# EAGLE design Main_PCB (EAGLE 9.5.1)

## Sheet 1 of 3
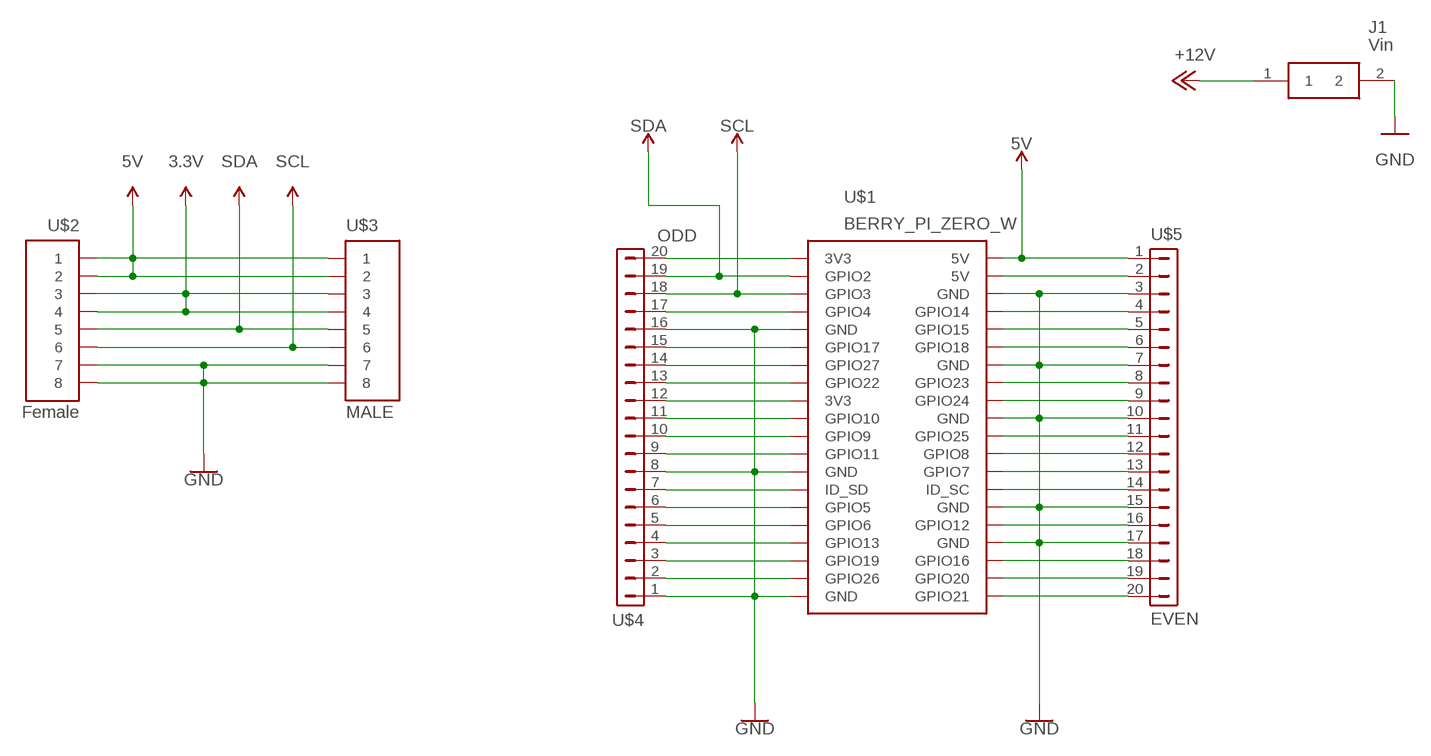
[diagram p0: schematic, sheet 1]

### Parts
J1  Vin  PUSH_TERMINAL_2WAYS  [1990009]
U$1  BERRY_PI_ZERO_W  [FE20-2]
U$2  Female  MODULARCONNECTOR  [MA04-2]
U$3  MALE  MODULARCONNECTOR  [MA04-2]
U$4  ODD  PARALLELHEADER  [FE20]
U$5  EVEN  PARALLELHEADER  [FE20]

### Nets
3.3V: U$2.3 U$2.4 U$3.3 U$3.4 ; also sheet 3
5V: U$1.2(5V) U$2.1 U$2.2 U$3.1 U$3.2 U$5.1 ; also sheet 2
5V@2: U$1.4(5V) U$5.2
+12V: J1.1 ; also sheet 2,3
GND: J1.2 U$1.6(GND) U$1.9(GND) U$1.14(GND) U$1.20(GND) U$1.25(GND) U$1.30(GND) U$1.34(GND) U$1.39(GND) U$2.7 U$2.8 U$3.7 U$3.8 U$4.1 U$4.8 U$4.16 U$5.3 U$5.7 U$5.10 U$5.15 U$5.17 ; also sheet 2,3
N$7: U$1.1(3V3) U$4.20
N$8: U$1.37(GPIO26) U$4.2
N$9: U$1.35(GPIO19) U$4.3
N$10: U$1.33(GPIO13) U$4.4
N$11: U$1.31(GPIO6) U$4.5
N$12: U$1.29(GPIO5) U$4.6
N$13: U$1.27(ID_SD) U$4.7
N$14: U$1.17(3V3) U$4.12
N$15: U$1.23(GPIO11) U$4.9
N$16: U$1.21(GPIO9) U$4.10
N$17: U$1.19(GPIO10) U$4.11
N$19: U$1.15(GPIO22) U$4.13
N$20: U$1.13(GPIO27) U$4.14
N$21: U$1.11(GPIO17) U$4.15
N$23: U$1.7(GPIO4) U$4.17
N$26: U$1.8(GPIO14) U$5.4
N$27: U$1.10(GPIO15) U$5.5
N$28: U$1.12(GPIO18) U$5.6
N$30: U$1.16(GPIO23) U$5.8
N$31: U$1.18(GPIO24) U$5.9
N$33: U$1.22(GPIO25) U$5.11
N$34: U$1.24(GPIO8) U$5.12
N$35: U$1.26(GPIO7) U$5.13
N$36: U$1.28(ID_SC) U$5.14
N$38: U$1.32(GPIO12) U$5.16
N$40: U$1.36(GPIO16) U$5.18
N$41: U$1.38(GPIO20) U$5.19
N$42: U$1.40(GPIO21) U$5.20
SCL: U$1.5(GPIO3) U$2.6 U$3.6 U$4.18
SDA: U$1.3(GPIO2) U$2.5 U$3.5 U$4.19

## Sheet 2 of 3: Buck 5Vout
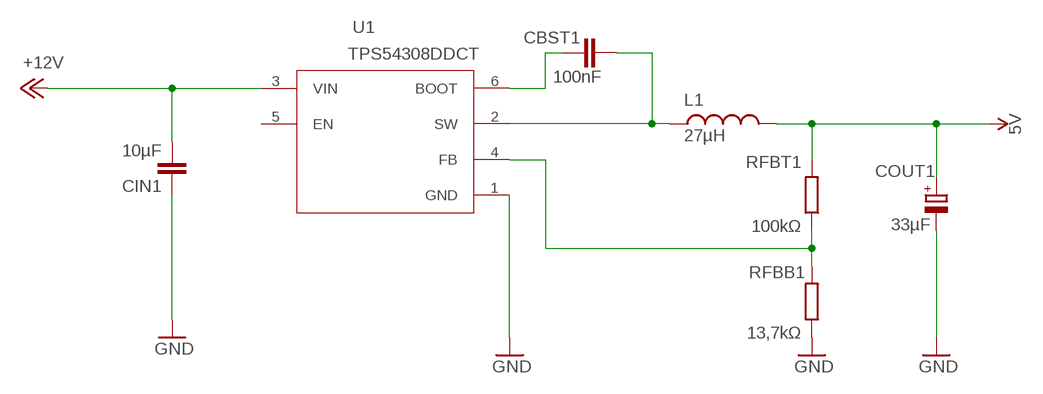
[diagram p1: schematic, sheet 2]

### Parts
CBST1  100nF  C-0603  [C0603]
CIN1  10µF  C-1210  [C1210]
COUT1  33µF  ELCO_TYPE_C  [PANASONIC_C]
L1  27µH  WE-PDF_1064_7447798910  [WE-PDF]
RFBB1  13,7kΩ  R-0603  [R0603]
RFBT1  100kΩ  R-0805  [R0805]
U1  TPS54308DDCT  [DDC6]

### Nets
5V: COUT1.+ L1.2 RFBT1.2 ; also sheet 1
+12V: CIN1.2 U1.3(VIN) ; also sheet 1,3
GND: CIN1.1 COUT1.- RFBB1.1 U1.1(GND) ; also sheet 1,3
N$3: CBST1.2 L1.1 U1.2(SW)
N$5: CBST1.1 U1.6(BOOT)
N$6: RFBB1.2 RFBT1.1 U1.4(FB)
Unconnected: U1.5(EN)

## Sheet 3 of 3: Buck 3.3Vout
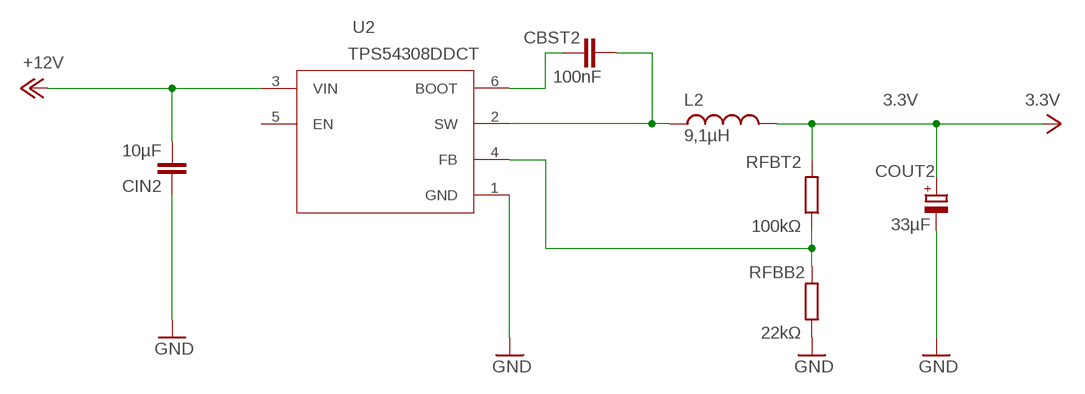
[diagram p2: schematic, sheet 3]

### Parts
CBST2  100nF  C-0603  [C0603]
CIN2  10µF  C-1210  [C1210]
COUT2  33µF  ELCO_TYPE_C  [PANASONIC_C]
L2  9,1µH  WE-PDF_1064_7447798910  [WE-PDF]
RFBB2  22kΩ  R-0603  [R0603]
RFBT2  100kΩ  R-0805  [R0805]
U2  TPS54308DDCT  [DDC6]

### Nets
3.3V: COUT2.+ L2.2 RFBT2.2 ; also sheet 1
+12V: CIN2.2 U2.3(VIN) ; also sheet 1,2
GND: CIN2.1 COUT2.- RFBB2.1 U2.1(GND) ; also sheet 1,2
N$1: CBST2.2 L2.1 U2.2(SW)
N$2: CBST2.1 U2.6(BOOT)
N$4: RFBB2.2 RFBT2.1 U2.4(FB)
Unconnected: U2.5(EN)

## Library data of the parts
CBST1 CBST2 = Main_lib:C-0603
CIN1 CIN2 = Main_lib:C-1210
COUT1 COUT2 = Main_lib:ELCO_TYPE_C
J1 = Main_lib:PUSH_TERMINAL_2WAYS: Phoenix Contact Non-Fused Terminal Block, 2 Way/Pole, Solder Terminals, 24 20 AWG Through Hole, Nylon, 160 V Source: Datasheet <https://componentsearchengine.com/Datasheets/1/1990009.pdf>; DESCRIPTION: Phoenix Contact Non-Fused Terminal Block, 2 Way/Pole, Solder Terminals, 24 20 AWG Through Hole, Nylon, 160 V; HEIGHT: 13mm; MANUFACTURER_NAME: Phoenix Contact; MANUFACTURER_PART_NUMBER: 1990009; MOUSER_PART_NUMBER: 651-1990009; MOUSER_PRICE-STOCK: https://www.mouser.com/Search/Refine.aspx?Keyword=651-1990009
L1 L2 = Main_lib:WE-PDF_1064: SMD Shielded Flatwire Power Inductor Characteristics Core material: NiZn Flat wire power inductor Advanced operating temperature: –40 °C up to +150 °C Magnetically shielded which results in a low leakage field Low self-losses High saturation current Flat wire coil for lower losses at high frequency ranges High Self Resonance Frequency Applications Suitable for high frequency switching regulators <http://katalog.we-online.de/media/images/v2/Family_WE-PDF%20Gruppe.jpg> Details see: http://katalog.we-online.de/en/pbs/WE-PDF? Updated by Dan Xu 2014-07-08 2014 (C) Wurth Elektronik; WE-NUMBER: 7447798910/9,1uH
RFBB1 RFBB2 = Main_lib:R-0603
RFBT1 RFBT2 = Main_lib:R-0805
U1 U2 = Main_lib:TPS54308DDCT; MANUFACTURER_PART_NUMBER: TPS54308DDCT; VENDOR: Texas Instruments
U$1 = Main_lib:BERRY_PI_ZERO_W
U$2 U$3 = Main_lib:MODULARCONNECTOR
U$4 U$5 = Main_lib:PARALLELHEADER

## Board
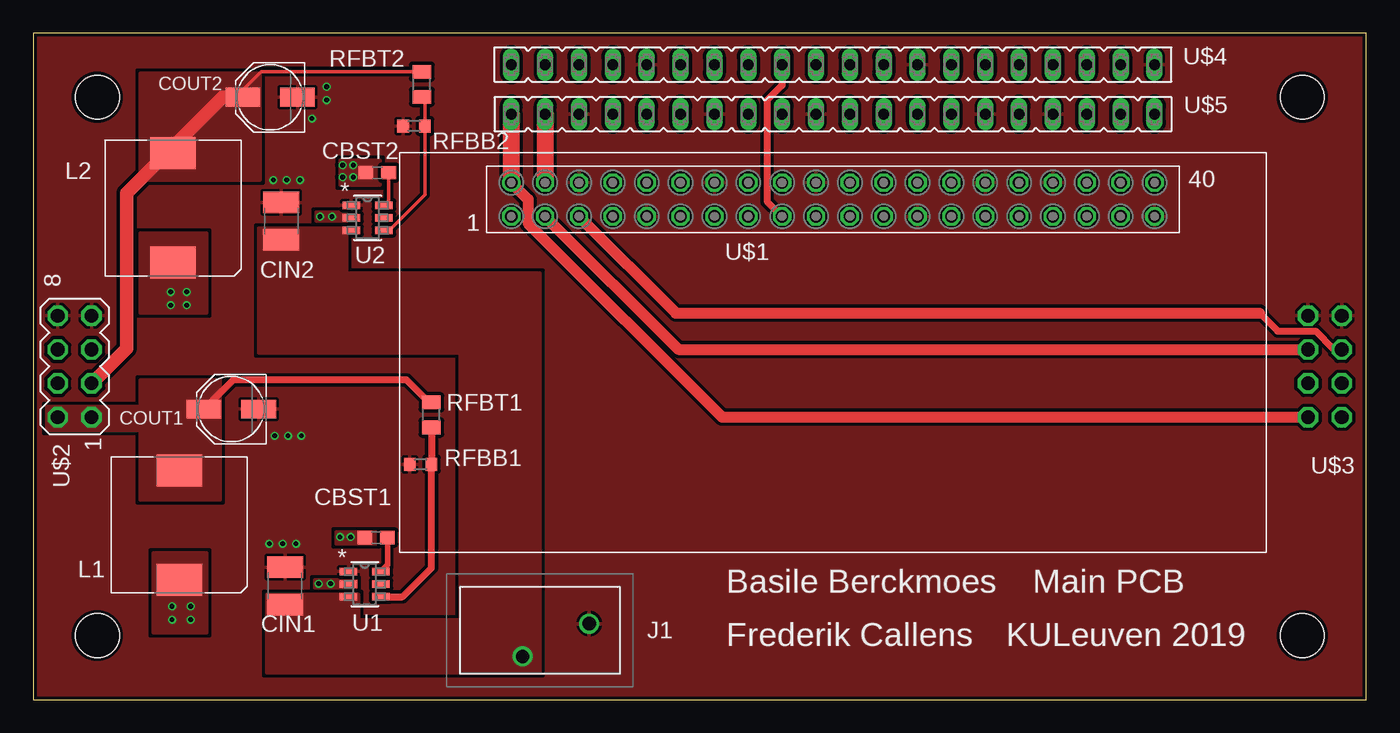
[diagram p3: board, top side]
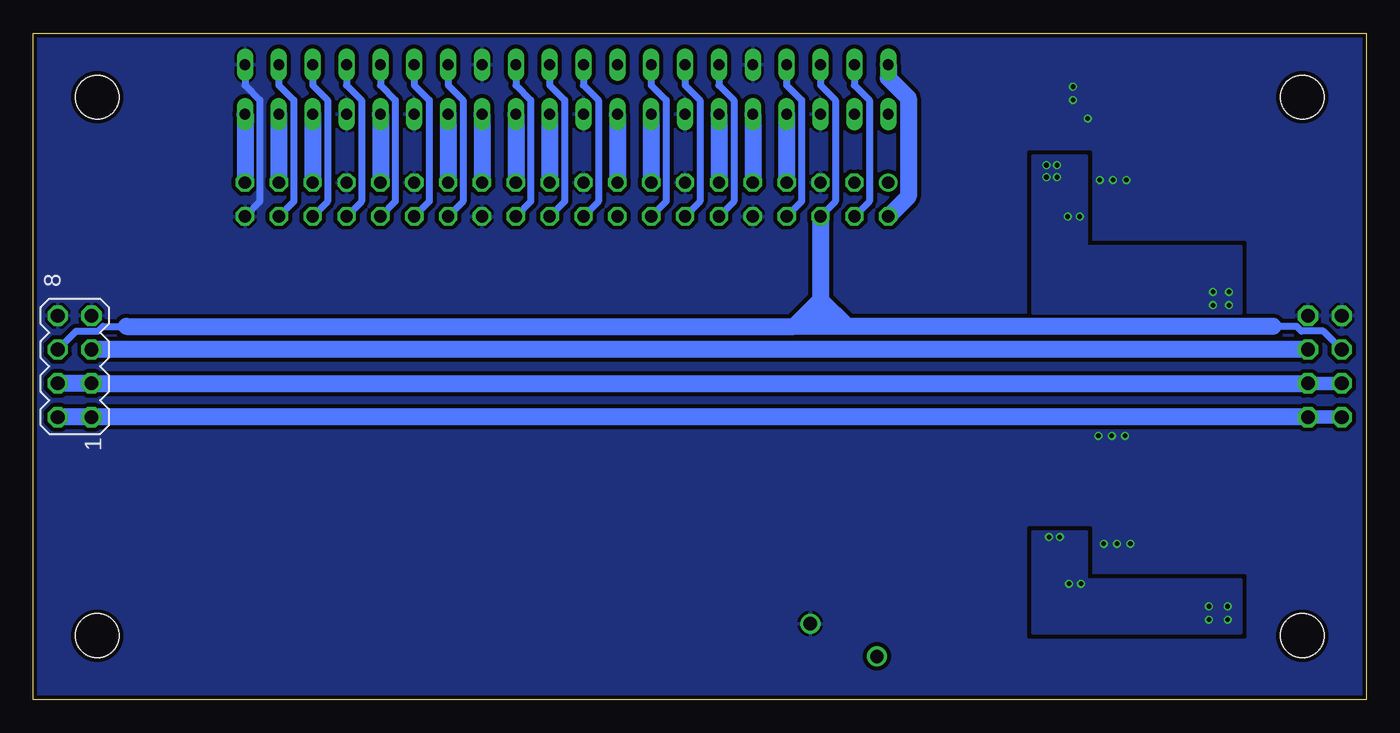
[diagram p4: board, bottom side, seen from below]

Size 100 x 50 mm. Coordinates in mm from the lower left corner, seen from the top.
Outline: 0,0 100,0 100,50 0,50 0,0
Copper layers (1*16): Top 0.018mm / dielectric 1.55mm / Bottom 0.018mm
Design rules "eC_2Layer_PClass6_BaseCopperO18_eCDefault": minimum track width 0.15mm, minimum drill 0.35mm, track to track 0.15mm, track to pad 0.15mm, pad to pad 0.15mm, via to via 0.15mm, smd to smd 0mil, copper to edge 0.25mm, drill to drill 0.35mm, minimum pad ring 0.175mm, minimum via ring 0.125mm, stop-mask expansion 0mil, vias tented up to drill 0.45mm, thermal gap 0.2mm
Holes 3.3 mm at 4.8,4.8 4.8,45.2 95.2,4.8 95.2,45.2

### Footprints (pad centres in the part's own frame; a part is rotated, then mirrored left to right if it is on the bottom)
C0603 = smd 1.1 x 1: 1 -0.85,0; 2 0.85,0
C1210 = smd 1.6 x 2.7: 1 -1.4,0; 2 1.4,0
PANASONIC_C = smd 2.6 x 1.4: + 2.05,0; - -2.05,0
1990009 = drill 1 pad 1.5: 1 1.22,-7.3; 2 -1.25,-2.3
WE-PDF = smd 2.4 x 3.4: 1 4.1,0; 2 -4.1,0
R0603 = smd 0.87 x 0.98: 1 -0.815,0; 2 0.815,0
R0805 = smd 1.02 x 1.4: 1 -0.94,0; 2 0.94,0
DDC6 = smd 1.321 x 0.559: 1 -1.219,0.95; 2 -1.219,0; 3 -1.219,-0.95; 4 1.219,-0.95; 5 1.219,0; 6 1.219,0.95
FE20-2 = drill 0.914 octagon: 1 -24.13,-1.27; 3 -21.59,-1.27; 4 -21.59,1.27; 5 -19.05,-1.27; 6 -19.05,1.27; 7 -16.51,-1.27; 8 -16.51,1.27; 9 -13.97,-1.27; 10 -13.97,1.27; 11 -11.43,-1.27; 12 -11.43,1.27; 13 -8.89,-1.27; 14 -8.89,1.27; 15 -6.35,-1.27; 16 -6.35,1.27; 17 -3.81,-1.27; 18 -3.81,1.27; 19 -1.27,-1.27; 20 -1.27,1.27; 21 1.27,-1.27; 22 1.27,1.27; 23 3.81,-1.27; 24 3.81,1.27; 25 6.35,-1.27; 26 6.35,1.27; 27 8.89,-1.27; 28 8.89,1.27; 29 11.43,-1.27; 30 11.43,1.27; 31 13.97,-1.27; 32 13.97,1.27; 33 16.51,-1.27; 34 16.51,1.27; 35 19.05,-1.27; 36 19.05,1.27; 37 21.59,-1.27; 38 21.59,1.27; 39 24.13,-1.27; 40 24.13,1.27 | drill 0.914: 2 -24.13,1.27
MA04-2 = drill 1.016 octagon: 1 -3.81,-1.27; 2 -3.81,1.27; 3 -1.27,-1.27; 4 -1.27,1.27; 5 1.27,-1.27; 6 1.27,1.27; 7 3.81,-1.27; 8 3.81,1.27
FE20 = drill 0.813 long: 1 -24.13,0; 2 -21.59,0; 3 -19.05,0; 4 -16.51,0; 5 -13.97,0; 6 -11.43,0; 7 -8.89,0; 8 -6.35,0; 9 -3.81,0; 10 -1.27,0; 11 1.27,0; 12 3.81,0; 13 6.35,0; 14 8.89,0; 15 11.43,0; 16 13.97,0; 17 16.51,0; 18 19.05,0; 19 21.59,0; 20 24.13,0

### Placement (x,y rotation side)
CBST1  25.72,12.16 180 top
CBST2  25.8,39.54 180 top
CIN1  18.88,8.53 270 top
CIN2  18.61,35.91 270 top
COUT1  14.85,21.8 180 top
COUT2  17.77,45.2 180 top
J1  44.01,4.45 270 top
L1  10.95,13.1 270 top
L2  10.48,36.9 270 top
RFBB1  29.06,17.66 0 top
RFBB2  28.56,43.04 0 top
RFBT1  29.86,21.36 90 top
RFBT2  29.15,46.17 90 top
U1  24.87,8.66 0 top
U2  25.08,36.15 0 top
U$1  59.99,37.53 0 top
U$2  3.1,25 90 top
U$3  96.9,25 90 bottom
U$4  59.99,47.65 180 top
U$5  59.99,43.93 0 top

### Tracks (layer width: path | path; a pad name or v marks a point on that pad's centre or on a via)
3.3V
  Top 0.254: RFBT2.2 17.11,47.11 15.72,45.72 COUT2.+
  Top 1.016: U$2.3 7,26.36 7,38 14.2,45.2 COUT2.+
  Bottom 1.016: U$2.3 U$2.4
  Bottom 1.27: U$2.3 U$3.3 U$3.4
  pour Top (isolate 0.254, no thermals): 8,47 8,39 17,39 17,47
5V
  Top 0.508: RFBT1.2 29.7,22.3 28,24 15,24 COUT1.+
  Top 0.813: U$1.2 37.13,37.53 37.13,35.73 51.67,21.19 U$3.1
  Top 1.27: U$5.1 U$1.2
  Bottom 1.016: U$2.1 U$2.2
  Bottom 1.27: U$2.1 U$3.1 U$3.2
  pour Top (isolate 0.254, no thermals): 8,24 8,15 14,15 14,24
  pour Top (isolate 0.254, no thermals): 1,22 9,22 9,20.2 1,20.2
5V@2
  Top 1.27: U$5.2 U$1.4
+12V
  pour Top (isolate 0.254, no thermals): 16.9,35.4 23.5,35.4 23.5,26 16.9,26
  pour Top (isolate 0.254, no thermals): 17.5,2 17.5,7.9 24.4,7.9 24.4,2
  pour Top (isolate 0.254, no thermals): 24.1,6 38,6 38,2 24.1,2
  pour Top (isolate 0.254, no thermals): 23,32 38,32 38,5 32,5 32,26 23,26
GND  (via drill 0.35)
  Bottom 0.508: U$4.1 84.12,46.1 83,44.98 83,37.38 U$1.39
  other vias: 22,46 22,45 18,39 19,39 20.9,43.6 20,39 20.1,19.8 19.1,19.8 18.1,19.8 17.7,11.7 18.7,11.7 19.7,11.7
  pour Top (isolate 0.254, rank 3): 0,50 0,0 100,0 100,50
  pour Bottom (isolate 0.3, rank 3): 0,50 100,50 100,0 0,0
N$1  (via drill 0.35)
  other vias: 10.3,30.6 11.5,30.6 11.5,29.6 10.3,29.6 24,39.2 24,40.1 22.4,36.25 21.5,36.25 23.2,40.1 23.2,39.2
  pour Top (isolate 0.254, no thermals): 23,40.5 23,38.6 26,38.6 26,40.5
  pour Top (isolate 0.254, no thermals): 23.5,35.9 23.5,36.6 21.2,36.6 21.2,35.9
  pour Top (isolate 0.254, no thermals): 8,34 8,29 13,29 13,35 8,35
  pour Bottom (isolate 0.254, no thermals): 21,40.8 21,29 25,29 25,40.8
  pour Bottom (isolate 0.254, no thermals): 21,29 9.4,29 9.4,34 21,34
N$2
  Top 0.254: U2.6 26.65,37.45 CBST2.1
N$3  (via drill 0.35)
  other vias: 10.4,7 11.8,7 11.8,6 10.4,6 22.3,8.7 21.4,8.7 23,12.2 23.8,12.2
  pour Top (isolate 0.254, no thermals): 26.4,11.7 26.4,12.6 22.7,12.6 22.7,11.7
  pour Top (isolate 0.254, no thermals): 21.1,9 21.1,8.4 24.2,8.4 24.2,9
  pour Top (isolate 0.254, no thermals): 9,11 9,5 13,5 13,11
  pour Bottom (isolate 0.254, no thermals): 9.4,9 9.4,5 25,5 25,12.6 21,12.6 21,9
N$4
  Top 0.254: U2.4 26.68,35.2 29.38,37.89 RFBB2.2 29.38,45.01 RFBT2.1
N$5
  Top 0.406: U1.6 26.57,10.09 CBST1.1
N$6
  Top 0.508: RFBT1.1 29.88,20.41 RFBB1.2 29.88,9.88 27.71,7.71 U1.4
N$7
  Bottom 1.27: U$4.20 35.86,46.64 34.36,45.14 34.36,37.76 U$1.1
N$8
  Bottom 0.508: U$4.2 81.58,46.1 80.46,44.98 80.46,37.38 U$1.37
N$9
  Bottom 0.508: U$4.3 79.04,46.1 77.92,44.98 77.92,37.38 U$1.35
N$10
  Bottom 0.508: U$4.4 76.5,46.1 75.38,44.98 75.38,37.38 U$1.33
N$11
  Bottom 0.508: U$4.5 73.96,46.1 72.84,44.98 72.84,37.38 U$1.31
N$12
  Bottom 0.508: U$4.6 71.42,46.1 70.3,44.98 70.3,37.38 U$1.29
N$13
  Bottom 0.508: U$4.7 68.88,46.1 67.76,44.98 67.76,37.38 U$1.27
N$14
  Top 0.508: U$4.12 56.18,46.1 55.06,44.98 55.06,37.38 U$1.17
N$15
  Bottom 0.508: U$4.9 63.8,46.1 62.68,44.98 62.68,37.38 U$1.23
N$16
  Bottom 0.508: U$4.10 61.26,46.1 60.14,44.98 60.14,37.38 U$1.21
N$17
  Bottom 0.508: U$4.11 58.72,46.1 57.6,44.98 57.6,37.38 U$1.19
N$19
  Bottom 0.508: U$4.13 53.64,46.1 52.52,44.98 52.52,37.38 U$1.15
N$20
  Bottom 0.508: U$4.14 51.1,46.1 49.98,44.98 49.98,37.38 U$1.13
N$21
  Bottom 0.508: U$4.15 48.56,46.1 47.44,44.98 47.44,37.38 U$1.11
N$23
  Bottom 0.508: U$4.17 43.48,46.1 42.36,44.98 42.36,37.38 U$1.7
N$26
  Bottom 1.27: U$5.4 U$1.8
N$27
  Bottom 1.27: U$5.5 U$1.10
N$28
  Bottom 1.27: U$5.6 U$1.12
N$30
  Bottom 1.27: U$5.8 U$1.16
N$31
  Bottom 1.27: U$5.9 U$1.18
N$33
  Bottom 1.27: U$5.11 U$1.22
N$34
  Bottom 1.27: U$5.12 U$1.24
N$35
  Bottom 1.27: U$5.13 U$1.26
N$36
  Bottom 1.27: U$5.14 U$1.28
N$38
  Bottom 1.27: U$5.16 U$1.32
N$40
  Bottom 1.27: U$5.18 U$1.36
N$41
  Bottom 1.27: U$5.19 U$1.38
N$42
  Bottom 1.27: U$5.20 U$1.40
SCL
  Top 0.508: U$3.6 97.58,26.27 96.21,27.64 93.36,27.64 92,29
  Top 0.813: U$1.5 48.2,29 92,29
  Bottom 0.508: U$2.6 3.2,27.64 4.85,27.64 5.21,28 7,28 | U$4.18 40.94,46.1 39.82,44.98 39.82,37.38 U$1.5 | 93,28 94.79,28 95.15,27.64 96.8,27.64 U$3.6
  Bottom 1.27: 7,28 39,28 | 39,28 41,28 | 41,28 42.94,28 | 93,28 42.94,28 | U$1.5 40.94,30 | 40.94,30 40.94,28.06 41,28 | 40.94,30 39,28.06 39,28 | 40.94,30 42.94,28
SDA
  Top 0.813: U$1.3 48.39,26.27 U$3.5
  Bottom 0.508: U$4.19 38.4,46.1 37.28,44.98 37.28,37.38 U$1.3
  Bottom 1.27: U$2.5 U$3.5

### Text on the board
tSilk: Basile Berckmoes | Main PCB | Frederik Callens | KULeuven 2019